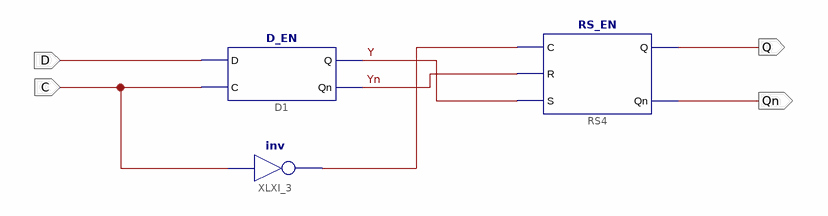
[diagram p0: schematic sheet 1]
// Xilinx ISE schematic D_Tri.sch (kintex7) as structural Verilog: 3 symbols, 4 ports
module D_Tri (
  input  C,
  input  D,
  output Q,
  output Qn
);

  wire XLXN_3, Y, Yn;

  D_EN D1 (.D(D), .C(C), .Q(Y), .Qn(Yn));
  RS_EN RS4 (.C(XLXN_3), .R(Yn), .S(Y), .Q(Q), .Qn(Qn));
  not XLXI_3 (XLXN_3, C);
endmodule
